# Altium project alarmClock.PrjPcb
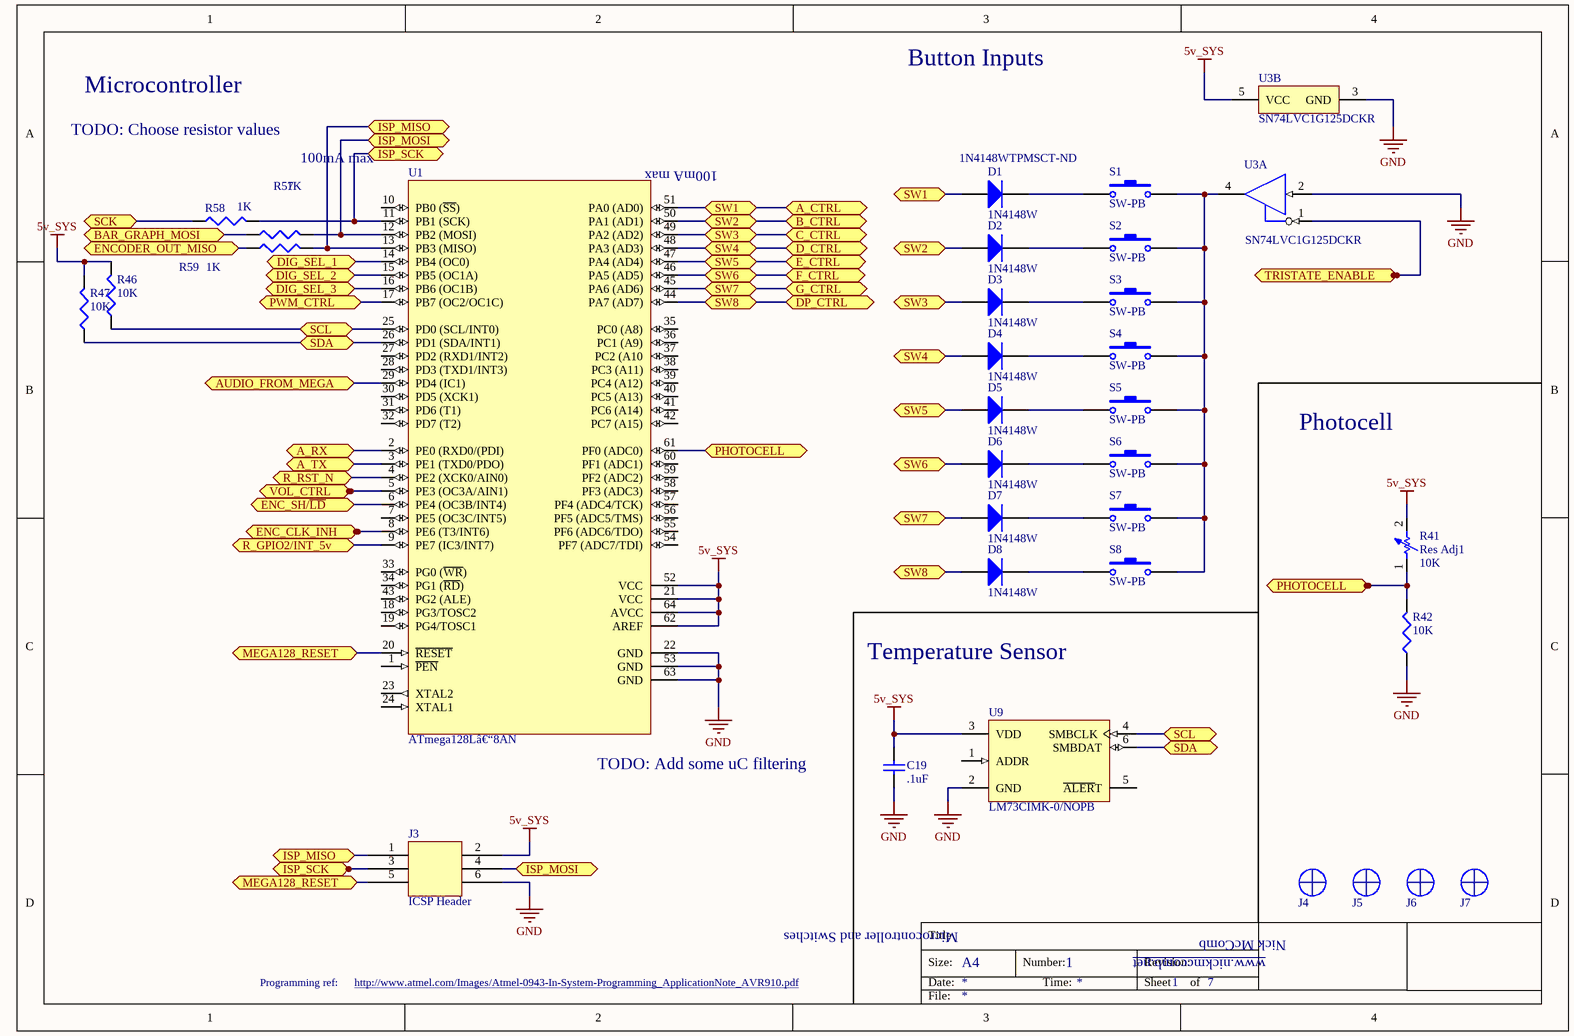
[diagram p0: uC.SchDoc]
7 sheets, 155 parts. Net scope: flat (ports and power ports of the same name join across sheets).
Board file: alarmClock.PcbDoc
Sheets:
  uC.SchDoc
  barGraph.SchDoc
  7Seg.SchDoc
  encoder.SchDoc
  radio.SchDoc
  audioAmp.SchDoc
  serial.SchDoc

## Sheet uC.SchDoc
size A4; Organization: Altium Limited; Address1: L3, 12a Rodborough Rd; Address2: Frenchs Forest; Address3: NSW; Address4: Australia 2086; DocumentNumber: 1; SheetNumber: 1; SheetTotal: 7

### Parts
C19  value .1uF  [C0805]  (hidden comment: 0805 style, by default)
D1  1N4148W  Supplier Part Number 1: 1N4148WTPMSCT-ND  [JSCJ-SOD-123-2_V]
D2  1N4148W  [JSCJ-SOD-123-2_V]
D3  1N4148W  [JSCJ-SOD-123-2_V]
D4  1N4148W  [JSCJ-SOD-123-2_V]
D5  1N4148W  [JSCJ-SOD-123-2_V]
D6  1N4148W  [JSCJ-SOD-123-2_V]
D7  1N4148W  [JSCJ-SOD-123-2_V]
D8  1N4148W  [JSCJ-SOD-123-2_V]
J3  ICSP Header  [ICSP Header]
J4  MountingHoles  [Mounting Hole - Single]  (value not drawn)
J5  MountingHoles  [Mounting Hole - Single]  (value not drawn)
J6  MountingHoles  [Mounting Hole - Single]  (value not drawn)
J7  MountingHoles  [Mounting Hole - Single]  (value not drawn)
R41  Res Adj1  value 10K  [PHOTOCELL]
R42  10K  [J1-0603]
R46  10K  [J1-0603]
R47  10K  [J1-0603]
R57  1K  [J1-0603]
R58  1K  [J1-0603]
R59  1K  [J1-0603]
S1  SW-PB  [SW-PB]
S2  SW-PB  [SW-PB]
S3  SW-PB  [SW-PB]
S4  SW-PB  [SW-PB]
S5  SW-PB  [SW-PB]
S6  SW-PB  [SW-PB]
S7  SW-PB  [SW-PB]
S8  SW-PB  [SW-PB]
U1  ATmega128Lâ€“8AN  [64A_M]
U3  SN74LVC1G125DCKR  [DCK0005A_M]  (parts A,B of 2)
U9  LM73CIMK-0/NOPB  [DDC0006A_M]

### Ports
A_CTRL, A_RX, A_TX, AUDIO_FROM_MEGA, B_CTRL, BAR_GRAPH_MOSI, C_CTRL, D_CTRL, DIG_SEL_1, DIG_SEL_2, DIG_SEL_3, DP_CTRL, E_CTRL, ENC_CLK_INH, ENC_SH/~{LD}, ENCODER_OUT_MISO, F_CTRL, G_CTRL, ISP_MISO, ISP_MOSI, ISP_SCK, MEGA128_RESET, PHOTOCELL, PWM_CTRL, R_GPIO2/INT_5v, R_RST_N, SCK, SCL, SDA, SW1, SW2, SW3, SW4, SW5, SW6, SW7, SW8, TRISTATE_ENABLE, VOL_CTRL

### Nets
5v_SYS: C19.2 J3.2 R41.2 R46.2 R47.2 U1.21(VCC) U1.52(VCC) U1.62(AREF) U1.64(AVCC) U3.5(VCC) U9.3(VDD)
GND: C19.1 J3.6 R42.1 U1.22(GND) U1.53(GND) U1.63(GND) U3.2(A) U3.3(GND) U9.2(GND)
NetC3_1: U1.29(PD4_(IC1)) ; port AUDIO_FROM_MEGA
NetD1_1: D1.1(+) U1.51(PA0_(AD0)) ; port SW1, port A_CTRL
NetD1_2: D1.2(-) S1.1
NetD2_1: D2.1(+) U1.50(PA1_(AD1)) ; port SW2, port B_CTRL
NetD2_2: D2.2(-) S2.1
NetD3_1: D3.1(+) U1.49(PA2_(AD2)) ; port SW3, port C_CTRL
NetD3_2: D3.2(-) S3.1
NetD4_1: D4.1(+) U1.48(PA3_(AD3)) ; port SW4, port D_CTRL
NetD4_2: D4.2(-) S4.1
NetD5_1: D5.1(+) U1.47(PA4_(AD4)) ; port SW5, port E_CTRL
NetD5_2: D5.2(-) S5.1
NetD6_1: D6.1(+) U1.46(PA5_(AD5)) ; port SW6, port F_CTRL
NetD6_2: D6.2(-) S6.1
NetD7_1: D7.1(+) U1.45(PA6_(AD6)) ; port SW7, port G_CTRL
NetD7_2: D7.2(-) S7.1
NetD8_1: D8.1(+) U1.44(PA7_(AD7)) ; port SW8, port DP_CTRL
NetD8_2: D8.2(-) S8.1
NetJ3_1: J3.1 R59.2 U1.13(PB3_(MISO)) ; port ISP_MISO
NetJ3_3: J3.3 R58.2 U1.11(PB1_(SCK)) ; port ISP_SCK
NetJ3_4: J3.4 R57.2 U1.12(PB2_(MOSI)) ; port ISP_MOSI
NetJ3_5: J3.5 U1.20(~{RESET}) ; port MEGA128_RESET
NetQ7_2: U1.4(PE2_(XCK0/AIN0)) ; port R_RST_N
NetR30_1: U1.17(PB7_(OC2/OC1C)) ; port PWM_CTRL
NetR41_1: R41.1 R42.2 U1.61(PF0_(ADC0)) ; port PHOTOCELL
NetR45_1: U1.5(PE3_(OC3A/AIN1)) ; port VOL_CTRL
NetR46_1: R46.1 U1.25(PD0_(SCL/INT0)) U9.4(SMBCLK) ; port SCL
NetR47_1: R47.1 U1.26(PD1_(SDA/INT1)) U9.6(SMBDAT) ; port SDA
NetR57_1: R57.1 ; port BAR_GRAPH_MOSI
NetR58_1: R58.1 ; port SCK
NetR59_1: R59.1 ; port ENCODER_OUT_MISO
NetS1_2: S1.2 S2.2 S3.2 S4.2 S5.2 S6.2 S7.2 S8.2 U3.4(Y)
NetU1_2: U1.2(PE0_(RXD0/(PDI)) ; port A_RX
NetU1_3: U1.3(PE1_(TXD0/PDO)) ; port A_TX
NetU1_6: U1.6(PE4_(OC3B/INT4)) ; port ENC_SH/~{LD}
NetU1_8: U1.8(PE6_(T3/INT6)) ; port ENC_CLK_INH
NetU1_9: U1.9(PE7_(IC3/INT7)) ; port R_GPIO2/INT_5v
NetU1_14: U1.14(PB4_(OC0)) ; port DIG_SEL_1
NetU1_15: U1.15(PB5_(OC1A)) ; port DIG_SEL_2
NetU1_16: U1.16(PB6_(OC1B)) ; port DIG_SEL_3
NetU2_7: U3.1(~{OE}) ; port TRISTATE_ENABLE

Not connected (* = marked no-connect by the designer): U1 1(~{PEN}) 7(PE5_(OC3C/INT5)) 10(PB0_(~{SS})) 18(PG3/TOSC2) 19(PG4/TOSC1) 23(XTAL2) 24(XTAL1) 27(PD2_(RXD1/INT2)) 28(PD3_(TXD1/INT3)) 30(PD5_(XCK1)) 31(PD6_(T1)) 32(PD7_(T2)) 33(PG0_(~{WR})) 34(PG1_(~{RD})) 35(PC0_(A8)) 36(PC1_(A9)) 37(PC2_(A10) 38(PC3_(A11)) 39(PC4_(A12)) 40(PC5_(A13)) 41(PC6_(A14)) 42(PC7_(A15)) 43(PG2_(ALE)) 54(PF7_(ADC7/TDI)) 55(PF6_(ADC6/TDO)) 56(PF5_(ADC5/TMS)) 57(PF4_(ADC4/TCK)) 58(PF3_(ADC3)) 59(PF2_(ADC2)) 60(PF1_(ADC1)); U9 1(ADDR) 5(~{ALER}T)

### Notes on the sheet
- Microcontroller
- Button Inputs
- TODO: Choose resistor values
- 100mA max
- Photocell
- Temperature Sensor
- TODO: Add some uC filtering
- Microcontroller and Switches
- Programming ref:
- http://www.atmel.com/Images/Atmel-0943-In-System-Programming_ApplicationNote_AVR910.pdf
- Title
- Size:
- Date:
- A4
- Number:
- Time:
- Revision:
- Sheet
- of
- www.nickmccomb.net
- Nick McComb
- File:

### Library data of the parts
C19 = Cap: Capacitor; Published: 8-Jun-2000; LatestRevisionDate: 17-Jul-2002; LatestRevisionNote: Re-released for DXP Platform.; PackageReference: RAD-0.3; Publisher: Altium Limited; PackageDescription: Radial Cap, Thru-Hole; 2 Leads; 0.3 in Pin Spacing
D1-D8 = CMP-0914-00001-1: Fast Switching Diode, 75 V, 150 mA, 2-Pin 2.7 x 1.6 x 1.25 mm SMD, Tape and Reel; Manufacturer: Changjiang Electronics; Manufacturer Part Number: 1N4148W-TP; TSTG (degC): -55 to 150; IR (uA): 1; VR (V): 75; VF (V): 1.25; PD (mW): 350; Trr (ns): 4; IO (mA): 150; Description: DIODE GEN PURP 100V 150MA SOD123; Average Forward Current-Max: 0.15 A; Peak Current-Max: 2 A; Power Dissipation: 400 mW; Reverse Voltage-Max [Vrrm]: 100 V; Reverse Recovery Time-Max: 4 ns; Packing: Tape and Reel; ComponentLink2URL: http://www.cj-elec.com/txUpfile/20121613352740313.pdf; PackageReference: SOD-123-2; PackageVersion: Rev. A; DatasheetVersion: Rev. A; ComponentLink3Description: Package Specification; ComponentLink3URL: http://www.cj-elec.com/txUpfile/201412112231195145.pdf; ComponentLink1Description: Manufacturer URL; ComponentLink1URL: http://www.cj-elec.com/; PartNumber: 1N4148W; ComponentLink2Description: Datasheet; PackageDescription: 2-Pin SMD, Body 2.7 x 1.6 mm, Height 1.25 mm; Mounting Technology: Surface Mount; Supplier 1: Digikey; Stock 1: 1103127; Pricing 1: 1=0.14, 10=0.125, 25=0.1132, 100=0.0815, 250=0.048, 500=0.0399, 1000=0.0272 (USD); ComponentLink4URL: https://datasheet.ciiva.com/1243/1684829-1243908.pdf; ComponentLink4Description: https://datasheet.ciiva.com/1243/1684829-1243908.pdf; ComponentLink5URL: https://datasheet.ciiva.com/16836/1n4148wsod123-16836277.pdf; ComponentLink5Description: https://datasheet.ciiva.com/16836/1n4148wsod123-16836277.pdf; ComponentLink6URL: https://datasheet.ciiva.com/4435/1n4148wsod123-48460-4435223.pdf; ComponentLink6Description: https://datasheet.ciiva.com/4435/1n4148wsod123-48460-4435223.pdf; ComponentLink7URL: https://datasheet.ciiva.com/14557/70055519-14557767.pdf; ComponentLink7Description: https://datasheet.ciiva.com/14557/70055519-14557767.pdf; ComponentLink8URL: https://datasheet.ciiva.com/911/1n4148wsod123-911676.pdf; ComponentLink8Description: https://datasheet.ciiva.com/911/1n4148wsod123-911676.pdf; ComponentLink9URL: https://datasheet.ciiva.com/7622/1684829-7622556.pdf; ComponentLink9Description: https://datasheet.ciiva.com/7622/1684829-7622556.pdf; ComponentLink10URL: https://datasheet.ciiva.com/911/1n4148wsod123-911677.pdf; ComponentLink10Description: https://datasheet.ciiva.com/911/1n4148wsod123-911677.pdf; ComponentLink11URL: https://datasheet.ciiva.com/911/1n4148wsod123-911678.pdf; ComponentLink11Description: https://datasheet.ciiva.com/911/1n4148wsod123-911678.pdf; ComponentLink12URL: https://datasheet.ciiva.com/22747/1684829-22747439.pdf; ComponentLink12Description: https://datasheet.ciiva.com/22747/1684829-22747439.pdf
  D2-D8: Supplier Part Number 1: 1N4148WTPMSCT-ND
R41 = Res Adj1: Variable Resistor; ComponentLink1URL: http://cdn.sparkfun.com/datasheets/Sensors/LightImaging/SEN-09088.pdf; ComponentLink1Description: A Photocell Datasheet
R42 R46 R47 R57-R59 = Res3: Resistor; Published: 8-Jun-2000; LatestRevisionDate: 29-May-2009; LatestRevisionNote: IPC-7351 Footprint Added.; PackageReference: J1-0603; Publisher: Altium Limited; PackageDescription: Chip Resistor
  R42 R46 R47: Value: 10K
  R57-R59: Value: 1K
S1-S8 = SW-PB: Switch
U1 = CMP-0095-00651-1: 8-bit AVR Microcontroller, 3.0-5.5V, 128KB Flash, 4KB EEPROM, 4KB SRAM, 64-pin TQFP, Extended Grade (-40°C to 105°C); PackageVersion: revC, Oct-2010; PackageDescription: 64-Pin Plastic Thin Profile Quad Flat Pack, 14 x 14 x 1.0 mm Body, 0.8 mm Pitch (TQFP); Code_JEDEC: MS-026-AEB; ComponentLink3Description: ATmega128(L) Summary; ComponentLink1URL: http://www.atmel.com/; PackageReference: 64A; ComponentLink2URL: http://www.atmel.com/dyn/resources/prod_documents/doc2467.pdf; DatasheetVersion: revX, Jun-2011; ComponentLink3URL: http://www.atmel.com/dyn/resources/prod_documents/2467S.pdf; ComponentLink2Description: ATmega128(L) Datasheet; ComponentLink1Description: Manufacturer URL
U3 = CMP-0859-00281-3: Single Bus Buffer Gate With 3-State Outputs, DCK0005A, LARGE T&R; Manufacturer: Texas Instruments; Bits(#): 1; tpd @ Nom Voltage(Max)(ns): 9,5.5,4.5,4; 3-State Output: Yes; Output Type: CMOS; Sub-Family: Non-Inverting Buffer/Driver; Logic: True; Output Drive (IOL/IOH)(Max)(mA): 32/-32; Voltage(Nom)(V): 1.8,2.5,3.3,5; ICC @ Nom Voltage(Max)(mA): 0.01; Technology Family: LVC; VCC(Min)(V): 1.65; VCC(Max)(V): 5.5; F @ Nom Voltage(Max)(Mhz): 150; Rating: Catalog; Input Type: CMOS/TTL; Schmitt Trigger: No; PackageReference: DCK0005A; Generic Part Number: SN74LVC1G125; DatasheetVersion: SCES223T; Operating Temperature Range(C): -40 to 125,-40 to 85; PartId: 1
U9 = CMP-0066-00221-3: 2.7V, 11- to 14- Bit Digital Temperature Sensor with 2-Wire Interface, 6-pin Tiny SOT23, Pb-Free; Manufacturer: Texas Instruments; PackageTopMarking: T730*XTT; PowerWise: Y; CompType: Temp Sensor IC; PackageDescription: Molded TSOT, 2.97 x 1.65 x 0.87mm Body, 6 Lead, 0.95mm Pitch; ComponentLink1Description: Datasheet URL; ComponentLink1URL: http://www.ti.com/general/docs/lit/getliterature.tsp?genericPartNumber=LM73&fileType=pdf; Code_IPC: SOT26A-6; RoHS: Y; PinCount: 6; Code_JEDEC: MO-193-AA; PackageReference: DDC0006A

## Sheet barGraph.SchDoc
size A4; Organization: Altium Limited; Address1: L3, 12a Rodborough Rd; Address2: Frenchs Forest; Address3: NSW; Address4: Australia 2086; DocumentNumber: 2; SheetNumber: 2; SheetTotal: 7
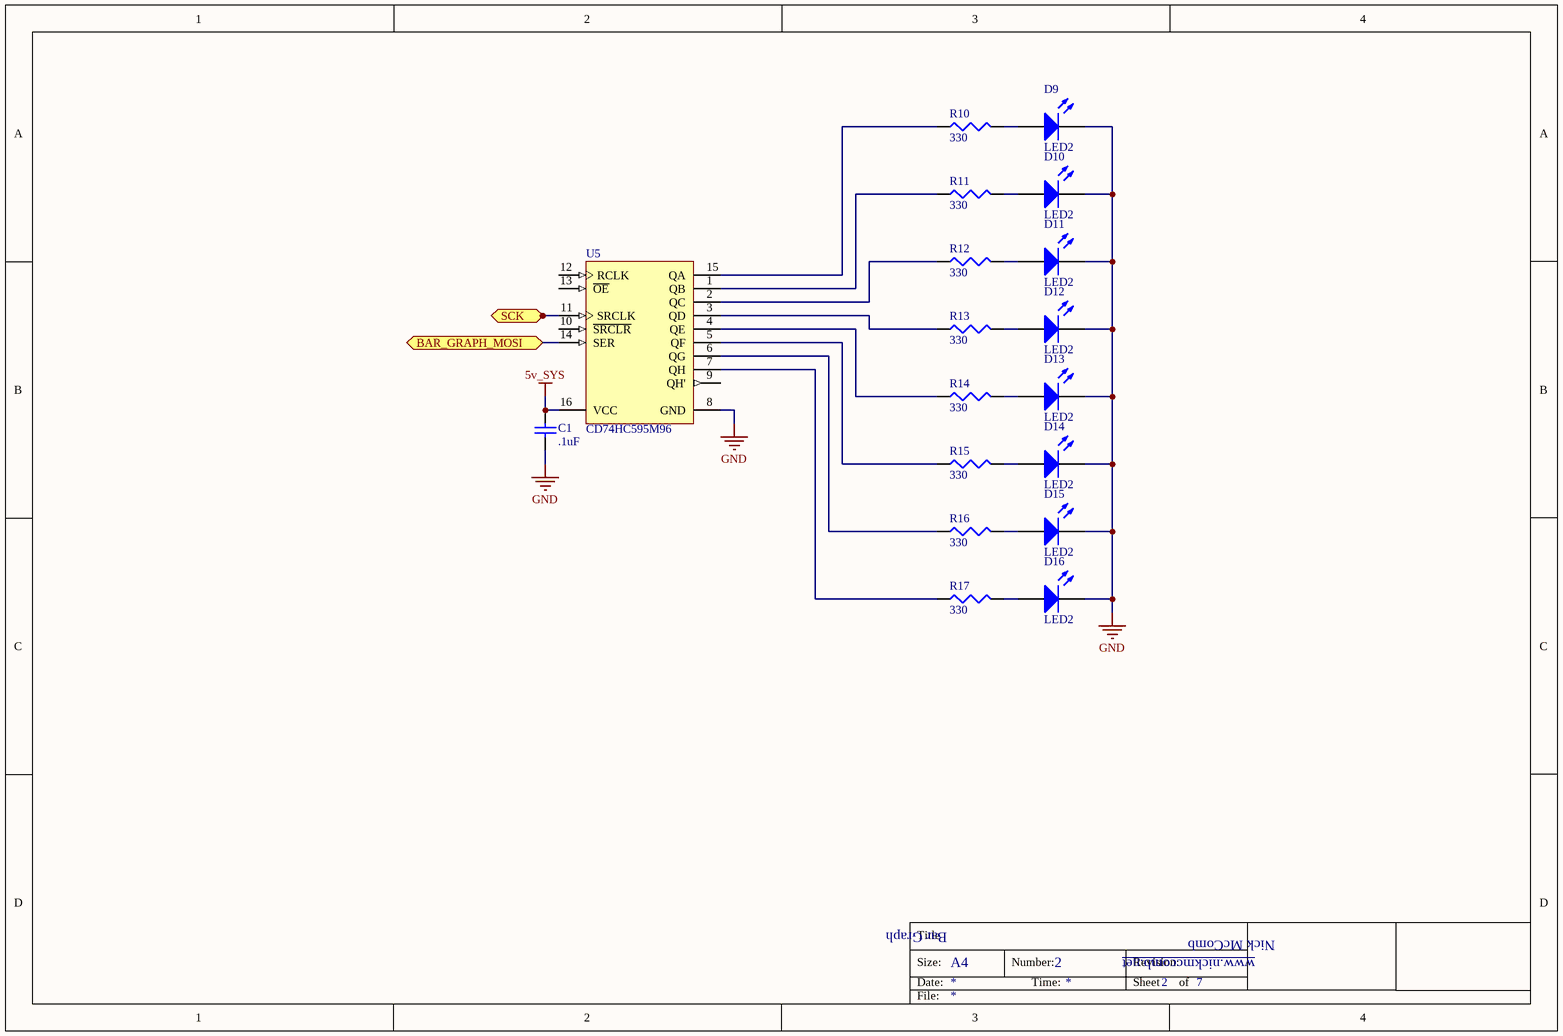
[diagram p1: barGraph.SchDoc]

### Parts
C1  value .1uF  [C0805]  (hidden comment: 0805 style, by default)
D9  LED2  [basic_led]
D10  LED2  [basic_led]
D11  LED2  [basic_led]
D12  LED2  [basic_led]
D13  LED2  [basic_led]
D14  LED2  [basic_led]
D15  LED2  [basic_led]
D16  LED2  [basic_led]
R10  330  [J1-0603]
R11  330  [J1-0603]
R12  330  [J1-0603]
R13  330  [J1-0603]
R14  330  [J1-0603]
R15  330  [J1-0603]
R16  330  [J1-0603]
R17  330  [J1-0603]
U5  CD74HC595M96  [D0016A_L]

### Ports
BAR_GRAPH_MOSI, SCK

### Nets
5v_SYS: C1.2 U5.16(VCC)
GND: C1.1 D9.2(K) D10.2(K) D11.2(K) D12.2(K) D13.2(K) D14.2(K) D15.2(K) D16.2(K) U5.8(GND)
NetD9_1: D9.1(A) R10.2
NetD10_1: D10.1(A) R11.2
NetD11_1: D11.1(A) R12.2
NetD12_1: D12.1(A) R13.2
NetD13_1: D13.1(A) R14.2
NetD14_1: D14.1(A) R15.2
NetD15_1: D15.1(A) R16.2
NetD16_1: D16.1(A) R17.2
NetR10_1: R10.1 U5.15(QA)
NetR11_1: R11.1 U5.1(QB)
NetR12_1: R12.1 U5.2(QC)
NetR13_1: R13.1 U5.3(QD)
NetR14_1: R14.1 U5.4(QE)
NetR15_1: R15.1 U5.5(QF)
NetR16_1: R16.1 U5.6(QG)
NetR17_1: R17.1 U5.7(QH)
NetR57_1: U5.14(SER) ; port BAR_GRAPH_MOSI
NetR58_1: U5.11(SRCLK) ; port SCK

Not connected (* = marked no-connect by the designer): U5 9(QH') 10(~{SRCLR}) 12(RCLK) 13(~{OE})

### Notes on the sheet
- Bar Graph
- Title
- Size:
- Date:
- A4
- Number:
- Time:
- Revision:
- Sheet
- of
- www.nickmccomb.net
- Nick McComb
- File:

### Library data of the parts
C1 = Cap: Capacitor; Published: 8-Jun-2000; LatestRevisionDate: 17-Jul-2002; LatestRevisionNote: Re-released for DXP Platform.; PackageReference: RAD-0.3; Publisher: Altium Limited; PackageDescription: Radial Cap, Thru-Hole; 2 Leads; 0.3 in Pin Spacing
D9-D16 = LED2: Typical RED, GREEN, YELLOW, AMBER GaAs LED; Published: 8-Jun-2000; LatestRevisionDate: 17-Jul-2002; LatestRevisionNote: Re-released for DXP Platform.; PackageVersion: Feb-2002; PackageReference: 3.2X1.6X1.1; Publisher: Altium Limited; PackageDescription: SM LED; 2 Flat Leads
R10-R17 = Res3: Resistor; Published: 8-Jun-2000; LatestRevisionDate: 29-May-2009; LatestRevisionNote: IPC-7351 Footprint Added.; PackageReference: J1-0603; Publisher: Altium Limited; PackageDescription: Chip Resistor; Value: 330
U5 = CMP-0807-00025-1: 8-Bit Shift Registers With 3-State Output Registers, D0016A, LARGE T&R; ICC @ Nom Voltage(Max)(mA): 0.08; 3-State Output: Yes; Input Type: CMOS; VCC(Max)(V): 6; Bits: 8; No. of Outputs: 9; VCC(Min)(V): 2; F @ Nom Voltage(Max)(Mhz): 28; Technology Family: HC; tpd @ Nom Voltage(Max)(ns): 41; Output Drive (IOL/IOH)(Max)(mA): 7.8/-7.8; Rating: Catalog; PackageVersion: http://www.ti.com/lit/ml/mpds178g/mpds178g.pdf; Code_IPC: MS-012 variation AC; Operating Temperature Range(C): -55 to 125; ComponentLink2Description: Datasheet; ComponentLink1Description: Manufacturer URL; ComponentLink2URL: http://www.ti.com/lit/ds/symlink/cd74hc595.pdf; PackageReference: D0016A; PartNumber: CD74HC595M96; Part Number: CD74HC595; DatasheetVersion: SCHS353; ComponentLink1URL: http://www.ti.com/; Output Type: CMOS; Voltage(Nom)(V): 6

## Sheet 7Seg.SchDoc
size A4; Organization: Altium Limited; Address1: L3, 12a Rodborough Rd; Address2: Frenchs Forest; Address3: NSW; Address4: Australia 2086; DocumentNumber: 3; SheetNumber: 3; SheetTotal: 7
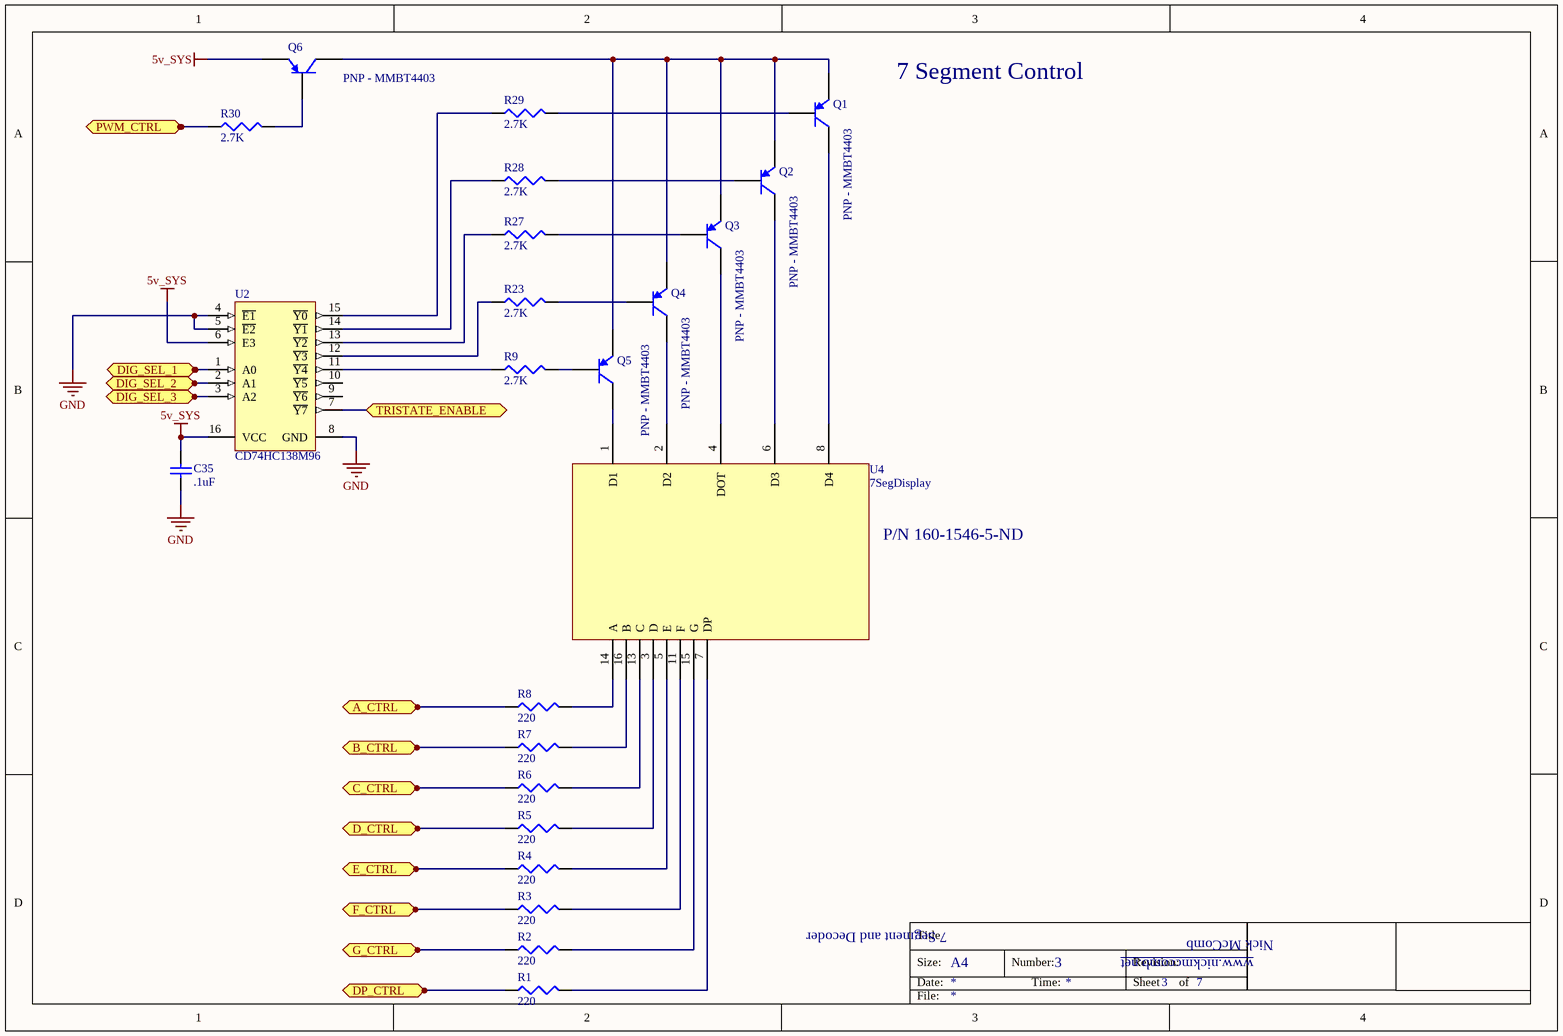
[diagram p2: 7Seg.SchDoc]

### Parts
C35  value .1uF  [C0805]  (hidden comment: 0805 style, by default)
Q1  PNP - MMBT4403  [TO-92A - BJT]
Q2  PNP - MMBT4403  [TO-92A - BJT]
Q3  PNP - MMBT4403  [TO-92A - BJT]
Q4  PNP - MMBT4403  [TO-92A - BJT]
Q5  PNP - MMBT4403  [TO-92A - BJT]
Q6  PNP - MMBT4403  [TO-92A - BJT]
R1  220  [J1-0603]
R2  220  [J1-0603]
R3  220  [J1-0603]
R4  220  [J1-0603]
R5  220  [J1-0603]
R6  220  [J1-0603]
R7  220  [J1-0603]
R8  220  [J1-0603]
R9  2.7K  [J1-0603]
R23  2.7K  [J1-0603]
R27  2.7K  [J1-0603]
R28  2.7K  [J1-0603]
R29  2.7K  [J1-0603]
R30  2.7K  [J1-0603]
U2  CD74HC138M96  [D0016A_L]
U4  7SegDisplay  [LTC-4627JS]

### Ports
A_CTRL, B_CTRL, C_CTRL, D_CTRL, DIG_SEL_1, DIG_SEL_2, DIG_SEL_3, DP_CTRL, E_CTRL, F_CTRL, G_CTRL, PWM_CTRL, TRISTATE_ENABLE

### Nets
5v_SYS: C35.2 Q6.3(E) U2.6(E3) U2.16(VCC)
GND: C35.1 U2.4(~{E1}) U2.5(~{E2}) U2.8(GND)
NetD1_1: R8.1 ; port A_CTRL
NetD2_1: R7.1 ; port B_CTRL
NetD3_1: R6.1 ; port C_CTRL
NetD4_1: R5.1 ; port D_CTRL
NetD5_1: R4.1 ; port E_CTRL
NetD6_1: R3.1 ; port F_CTRL
NetD7_1: R2.1 ; port G_CTRL
NetD8_1: R1.1 ; port DP_CTRL
NetQ1_1: Q1.1(C) U4.8(D4)
NetQ1_2: Q1.2(B) R29.2
NetQ1_3: Q1.3(E) Q2.3(E) Q3.3(E) Q4.3(E) Q5.3(E) Q6.1(C)
NetQ2_1: Q2.1(C) U4.6(D3)
NetQ2_2: Q2.2(B) R28.2
NetQ3_1: Q3.1(C) U4.4(DOT)
NetQ3_2: Q3.2(B) R27.2
NetQ4_1: Q4.1(C) U4.2(D2)
NetQ4_2: Q4.2(B) R23.2
NetQ5_1: Q5.1(C) U4.1(D1)
NetQ5_2: Q5.2(B) R9.2
NetQ6_2: Q6.2(B) R30.2
NetR1_2: R1.2 U4.7(DP)
NetR2_2: R2.2 U4.15(G)
NetR3_2: R3.2 U4.11(F)
NetR4_2: R4.2 U4.5(E)
NetR5_2: R5.2 U4.3(D)
NetR6_2: R6.2 U4.13(C)
NetR7_2: R7.2 U4.16(B)
NetR8_2: R8.2 U4.14(A)
NetR9_1: R9.1 U2.11(~{Y4})
NetR23_1: R23.1 U2.12(~{Y3})
NetR27_1: R27.1 U2.13(~{Y2})
NetR28_1: R28.1 U2.14(~{Y1})
NetR29_1: R29.1 U2.15(~{Y0})
NetR30_1: R30.1 ; port PWM_CTRL
NetU1_14: U2.1(A0) ; port DIG_SEL_1
NetU1_15: U2.2(A1) ; port DIG_SEL_2
NetU1_16: U2.3(A2) ; port DIG_SEL_3
NetU2_7: U2.7(~{Y7}) ; port TRISTATE_ENABLE

Not connected (* = marked no-connect by the designer): U2 9(~{Y6}) 10(~{Y5})

### Notes on the sheet
- 7 Segment Control
- P/N 160-1546-5-ND
- 7 Segment and Decoder
- Title
- Size:
- Date:
- A4
- Number:
- Time:
- Revision:
- Sheet
- of
- www.nickmccomb.net
- Nick McComb
- File:

### Library data of the parts
C35 = Cap: Capacitor; Published: 8-Jun-2000; LatestRevisionDate: 17-Jul-2002; LatestRevisionNote: Re-released for DXP Platform.; PackageReference: RAD-0.3; Publisher: Altium Limited; PackageDescription: Radial Cap, Thru-Hole; 2 Leads; 0.3 in Pin Spacing
Q1-Q6 = PNP - MMBT4403: PNP Bipolar Transistor
R1-R9 R23 R27-R30 = Res3: Resistor; Published: 8-Jun-2000; LatestRevisionDate: 29-May-2009; LatestRevisionNote: IPC-7351 Footprint Added.; PackageReference: J1-0603; Publisher: Altium Limited; PackageDescription: Chip Resistor
  R1-R8: Value: 220
  R9 R23 R27-R30: Value: 2.7K
U2 = CMP-1633-00157-2: High Speed CMOS Logic 3-to-8 Line Decoder Demultiplexer Inverting and Non-Inverting, D0016A, LARGE T&R; Manufacturer: Texas Instruments; VCC(Max)(V): 6; Technology Family: HC; Function: Decoder/Demultiplexer; tpd @ Nom Voltage(Max)(ns): 30; ICC @ Nom Voltage(Max)(mA): 0.08; Input Type: LVTTL/CMOS; Configuration: 3：8; Voltage(Nom)(V): 3.3,5; Schmitt Trigger: No; Channels(#): 1; Output Drive (IOL/IOH)(Max)(mA): 5.2/-5.2; F @ Nom Voltage(Max)(Mhz): 28; VCC(Min)(V): 2; Bits(#): 8; Rating: Catalog; PackageReference: D0016A; Operating Temperature Range(C): -55 to 125; Code_JEDEC: MS-012 variation AC; Generic Part Number: CD74HC138; Output Type: CMOS; DatasheetVersion: SCHS147I; Type: Standard

## Sheet encoder.SchDoc
size A4; Organization: Altium Limited; Address1: L3, 12a Rodborough Rd; Address2: Frenchs Forest; Address3: NSW; Address4: Australia 2086; DocumentNumber: 4; SheetNumber: 4; SheetTotal: 7
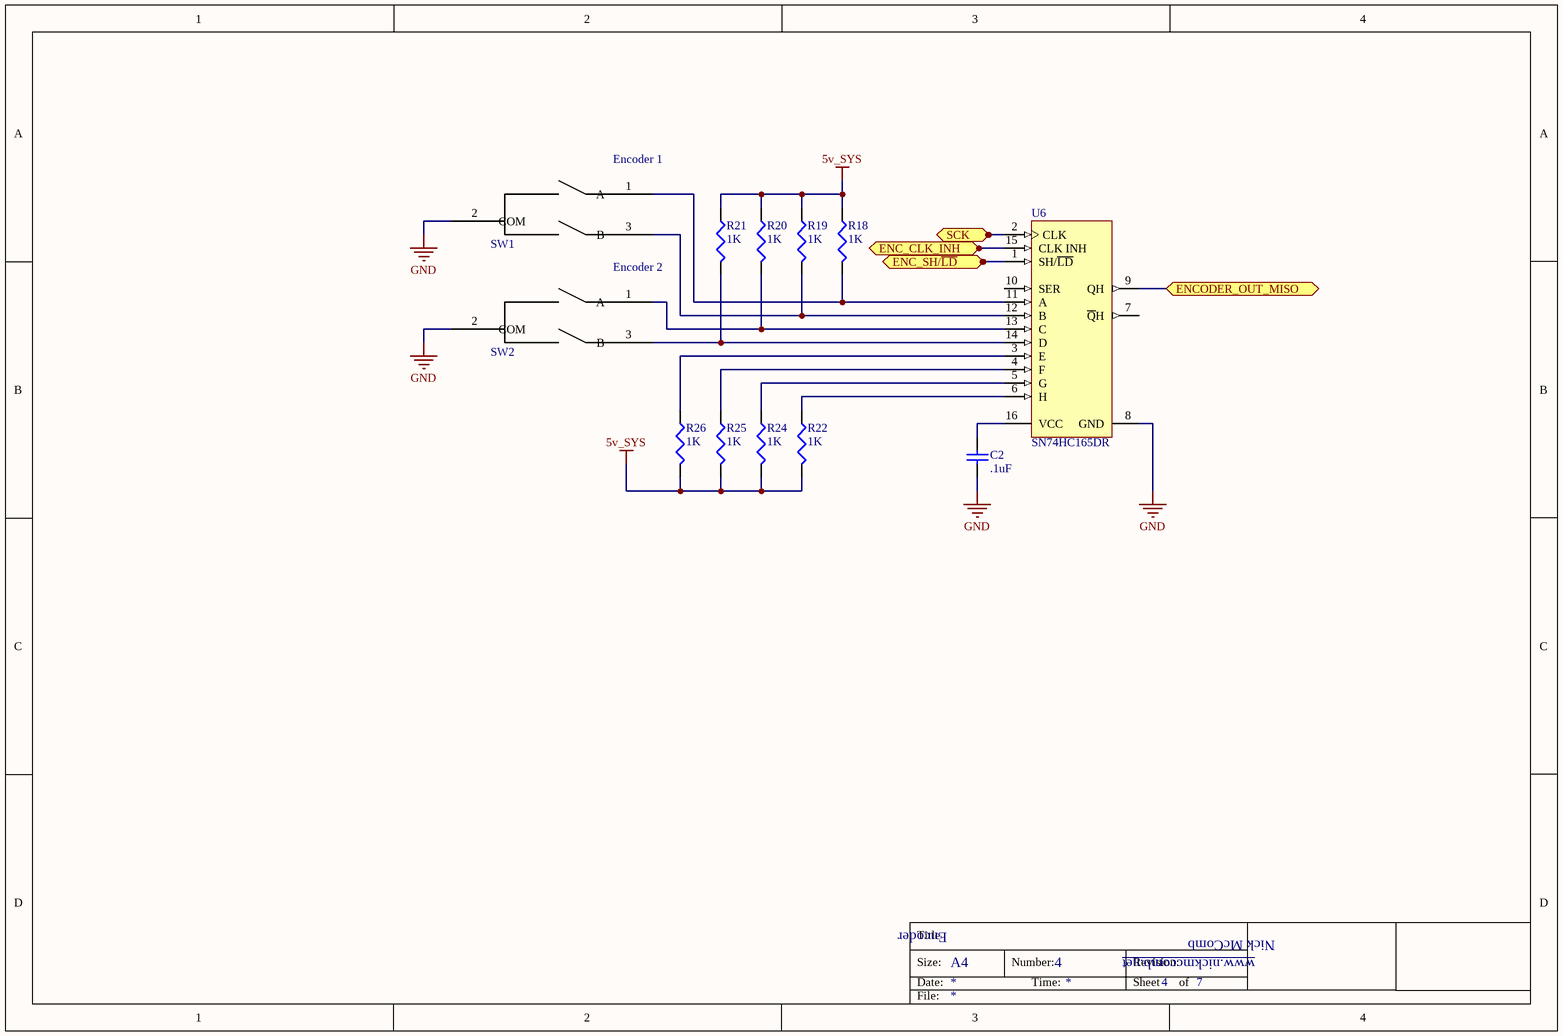
[diagram p3: encoder.SchDoc]

### Parts
C2  value .1uF  [C0805]  (hidden comment: 0805 style, by default)
R18  1K  [J1-0603]
R19  1K  [J1-0603]
R20  1K  [J1-0603]
R21  1K  [J1-0603]
R22  1K  [J1-0603]
R24  1K  [J1-0603]
R25  1K  [J1-0603]
R26  1K  [J1-0603]
SW1  ENCODER  [ENCODER]  (value not drawn)
SW2  ENCODER  [ENCODER]  (value not drawn)
U6  SN74HC165DR  [D0016A_L]

### Ports
ENC_CLK_INH, ENC_SH/~{LD}, ENCODER_OUT_MISO, SCK

### Nets
5v_SYS: R18.2 R19.2 R20.2 R21.2 R22.1 R24.1 R25.1 R26.1
GND: C2.1 SW1.2(COM) SW2.2(COM) U6.8(GND)
NetC2_2: C2.2 U6.16(VCC)
NetR18_1: R18.1 SW1.1(A) U6.11(A)
NetR19_1: R19.1 SW1.3(B) U6.12(B)
NetR20_1: R20.1 SW2.1(A) U6.13(C)
NetR21_1: R21.1 SW2.3(B) U6.14(D)
NetR22_2: R22.2 U6.6(H)
NetR24_2: R24.2 U6.5(G)
NetR25_2: R25.2 U6.4(F)
NetR26_2: R26.2 U6.3(E)
NetR58_1: U6.2(CLK) ; port SCK
NetR59_1: U6.9(QH) ; port ENCODER_OUT_MISO
NetU1_6: U6.1(SH/~{LD}) ; port ENC_SH/~{LD}
NetU1_8: U6.15(CLK_INH) ; port ENC_CLK_INH

Not connected (* = marked no-connect by the designer): U6 7(~{Q}H) 10(SER)

### Notes on the sheet
- (near SW1) Encoder 1
- Encoder 2
- Encoder
- Title
- Size:
- Date:
- A4
- Number:
- Time:
- Revision:
- Sheet
- of
- www.nickmccomb.net
- Nick McComb
- File:

### Library data of the parts
C2 = Cap: Capacitor; Published: 8-Jun-2000; LatestRevisionDate: 17-Jul-2002; LatestRevisionNote: Re-released for DXP Platform.; PackageReference: RAD-0.3; Publisher: Altium Limited; PackageDescription: Radial Cap, Thru-Hole; 2 Leads; 0.3 in Pin Spacing
R18-R22 R24-R26 = Res3: Resistor; Published: 8-Jun-2000; LatestRevisionDate: 29-May-2009; LatestRevisionNote: IPC-7351 Footprint Added.; PackageReference: J1-0603; Publisher: Altium Limited; PackageDescription: Chip Resistor; Value: 1K
U6 = CMP-0780-00020-1: 8-Bit Parallel-Load Shift Registers, D0016A, LARGE T&R; F @ Nom Voltage(Max)(Mhz): 28; Rating: Catalog; VCC(Max)(V): 6; VCC(Min)(V): 2; tpd @ Nom Voltage(Max)(ns): 38; Output Drive (IOL/IOH)(Max)(mA): 5.2/-5.2; Bits: 8; 3-State Output: No; Output Type: CMOS; ICC @ Nom Voltage(Max)(mA): 0.08; Technology Family: HC; Operating Temperature Range(C): -40 to 125; PartNumber: SN74HC165DR; Code_IPC: MS-012 variation AC; PackageReference: D0016A; ComponentLink1Description: Manufacturer URL; ComponentLink2URL: http://www.ti.com/lit/ds/symlink/sn74hc165.pdf; Input Type: CMOS; ComponentLink2Description: Datasheet; PackageVersion: http://www.ti.com/lit/ml/mpds178g/mpds178g.pdf; Part Number: SN74HC165; ComponentLink1URL: http://www.ti.com/; Voltage(Nom)(V): 6; DatasheetVersion: SCLS116G

## Sheet radio.SchDoc
size A4; Organization: Altium Limited; Address1: L3, 12a Rodborough Rd; Address2: Frenchs Forest; Address3: NSW; Address4: Australia 2086; DocumentNumber: 5; SheetNumber: 5; SheetTotal: 7
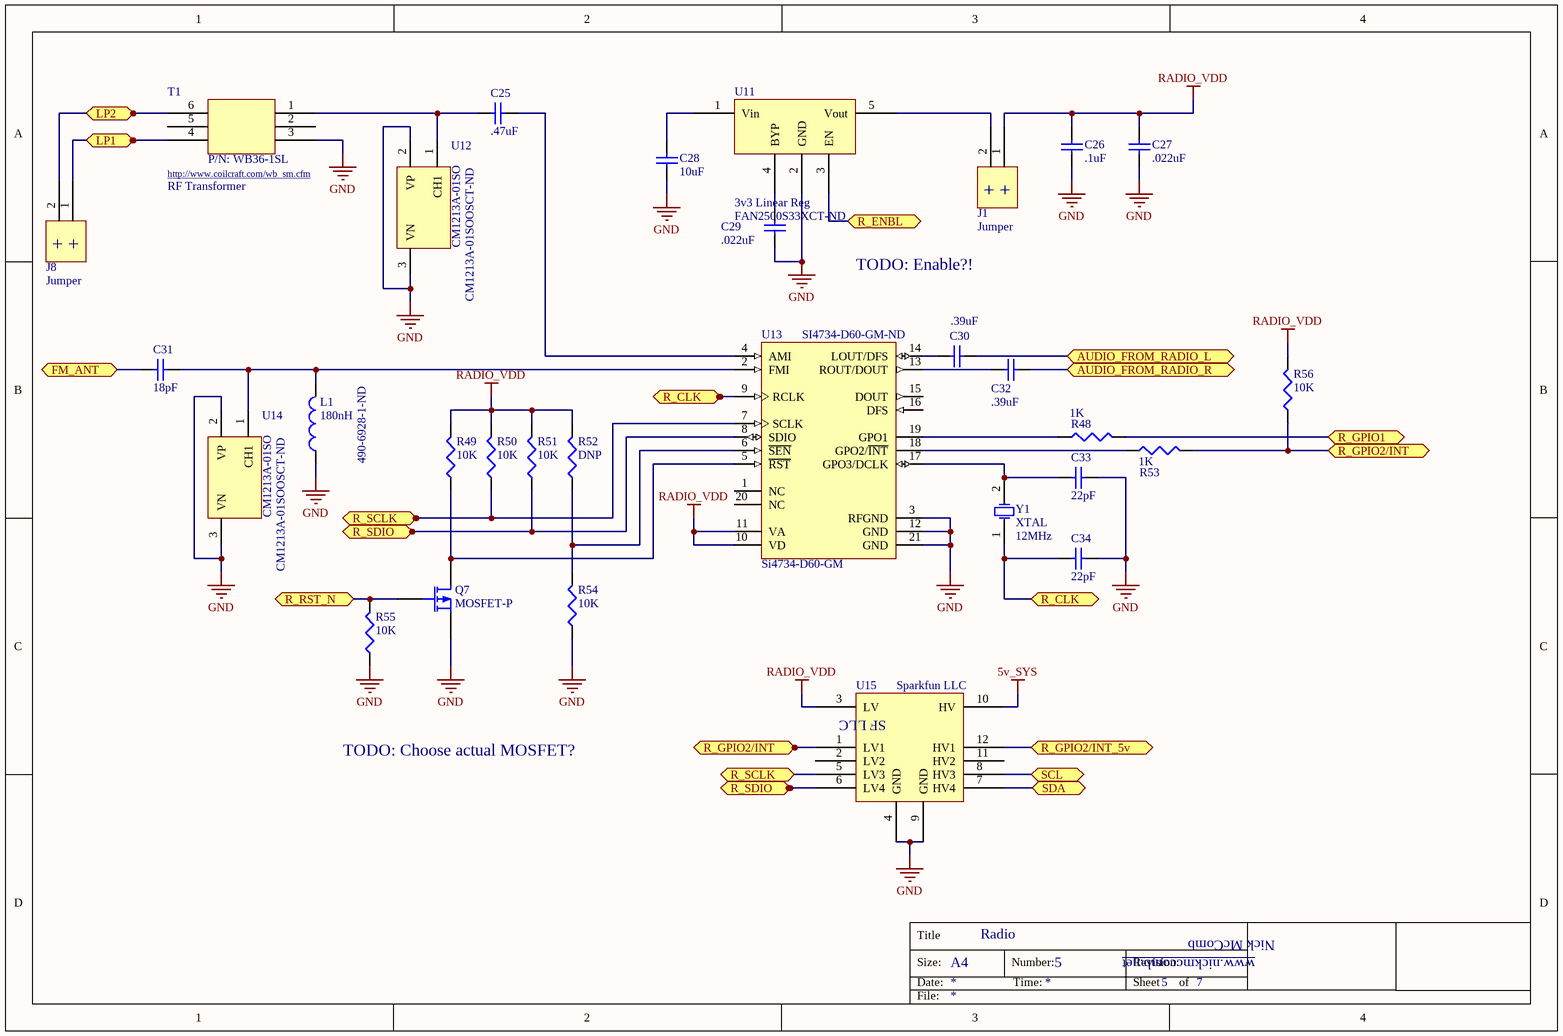
[diagram p4: radio.SchDoc]

### Parts
C25  value .47uF  [C0805]  (hidden comment: 0805 style, by default)
C26  value .1uF  [C0805]  (hidden comment: 0805 style, by default)
C27  value .022uF  [C0805]  (hidden comment: 0805 style, by default)
C28  value 10uF  [C0805]  (hidden comment: 0805 style, by default)
C29  value .022uF  [C0805]  (hidden comment: 0805 style, by default)
C30  value .39uF  [C0805]  (hidden comment: 0805 style, by default)
C31  value 18pF  [C0805]  (hidden comment: 0805 style, by default)
C32  value .39uF  [C0805]  (hidden comment: 0805 style, by default)
C33  value 22pF  [C0805]  (hidden comment: 0805 style, by default)
C34  value 22pF  [C0805]  (hidden comment: 0805 style, by default)
J1  Jumper  [Jumper]
J8  Jumper  [Jumper]
L1  180nH  Supplier Part Number 1: 490-6928-1-ND  [J1-0603]
Q7  MOSFET-P  [E3]
R48  1K  [J1-0603]
R49  10K  [J1-0603]
R50  10K  [J1-0603]
R51  10K  [J1-0603]
R52  DNP  [J1-0603]
R53  1K  [J1-0603]
R54  10K  [J1-0603]
R55  10K  [J1-0603]
R56  10K  [J1-0603]
T1  RF Transformer  [WB Series RF Transformers]
U11  3v3 Linear Reg  Supplier Part Number 1: FAN2500S33XCT-ND  [SOT95P245X110-5N]
U12  CM1213A-01SO  Supplier Part Number 1: CM1213A-01SOOSCT-ND  [ONSC-SOT-23-3-318-08_V]
U13  Si4734-D60-GM  Supplier Part Number 1: SI4734-D60-GM-ND  [SLAB-QFN-20-1700x1700TP_V]
U14  CM1213A-01SO  Supplier Part Number 1: CM1213A-01SOOSCT-ND  [ONSC-SOT-23-3-318-08_V]
U15  Sparkfun LLC  [Sparkfun LLC]
Y1  XTAL  Frequency: 12MHz  [XTAL_PDB]

### Ports
AUDIO_FROM_RADIO_L, AUDIO_FROM_RADIO_R, FM_ANT, LP1, LP2, R_CLK, R_ENBL, R_GPIO1, R_GPIO2/INT, R_GPIO2/INT_5v, R_RST_N, R_SCLK, R_SDIO, SCL, SDA

### Nets
5v_SYS: U15.10(HV)
GND: C26.1 C27.1 C28.1 C29.1 C33.1 C34.1 L1.1 Q7.3(S) R54.1 R55.1 T1.3 U11.2(GND) U12.2(VP) U12.3(VN) U13.3(RFGND) U13.12(GND) U13.21(GND) U14.2(VP) U14.3(VN) U15.4(GND) U15.9(GND)
RADIO_VDD: C26.2 C27.2 J1.1 R49.2 R50.2 R51.2 R52.2 R56.2 U13.10(VD) U13.11(VA) U15.3(LV)
NetC25_1: C25.1 U13.4(AMI)
NetC25_2: C25.2 T1.1 U12.1(CH1)
NetC28_2: C28.2 U11.1(Vin)
NetC29_2: C29.2 U11.4(BYP)
NetC30_1: C30.1 U13.14(LOUT/DFS)
NetC30_2: C30.2 ; port AUDIO_FROM_RADIO_L
NetC31_1: C31.1 L1.2 U13.2(FMI) U14.1(CH1)
NetC31_2: C31.2 ; port FM_ANT
NetC32_1: C32.1 U13.13(ROUT/DOUT)
NetC32_2: C32.2 ; port AUDIO_FROM_RADIO_R
NetC33_2: C33.2 U13.17(GPO3/DCLK) Y1.2(OSC2)
NetC34_2: C34.2 U13.9(RCLK) Y1.1(OSC1) ; port R_CLK
NetJ1_2: J1.2 U11.5(Vout)
NetJ8_1: J8.1 T1.4 ; port LP1
NetJ8_2: J8.2 T1.6 ; port LP2
NetQ7_1: Q7.1(D) R49.1 U13.5(~{RST})
NetQ7_2: Q7.2(G) R55.2 ; port R_RST_N
NetR46_1: U15.8(HV3) ; port SCL
NetR47_1: U15.7(HV4) ; port SDA
NetR48_1: R48.1 U13.19(GPO1)
NetR48_2: R48.2 ; port R_GPIO1
NetR50_1: R50.1 U13.7(SCLK) U15.5(LV3) ; port R_SCLK
NetR51_1: R51.1 U13.8(SDIO) U15.6(LV4) ; port R_SDIO
NetR52_1: R52.1 R54.2 U13.6(~{SEN})
NetR53_1: R53.1 U13.18(GPO2/~{INT})
NetR53_2: R53.2 R56.1 U15.1(LV1) ; port R_GPIO2/INT
NetU1_9: U15.12(HV1) ; port R_GPIO2/INT_5v
NetU11_3: U11.3(EN) ; port R_ENBL

Not connected (* = marked no-connect by the designer): T1 2 5; U13 1(NC) 15(DOUT) 16(DFS) 20(NC); U15 2(LV2) 11(HV2)

### Notes on the sheet
- TODO: Enable?!
- TODO: Choose actual MOSFET?
- Title
- Size:
- Date:
- A4
- Radio
- Number:
- Time:
- Revision:
- Sheet
- of
- www.nickmccomb.net
- Nick McComb
- File:
- (in symbol Jumper) + +
- (in symbol RF Transformer) P/N: WB36-1SL; http://www.coilcraft.com/wb_sm.cfm
- (in symbol Sparkfun LLC) SF LLC

### Library data of the parts
C25-C34 = Cap: Capacitor; Published: 8-Jun-2000; LatestRevisionDate: 17-Jul-2002; LatestRevisionNote: Re-released for DXP Platform.; PackageReference: RAD-0.3; Publisher: Altium Limited; PackageDescription: Radial Cap, Thru-Hole; 2 Leads; 0.3 in Pin Spacing
L1 = Inductor: Manufacturer: Murata; Manufacturer Part Number: LQW18ANR18J00D; Description: Fixed Inductors 180 NH 5%; Product Training Modules: Inductor Products Chip RF Inductors; Type: Wirewound; Material - Core: Non-Magnetic; Tolerance: ±5%; Current Rating: 140mA; Shielding: Unshielded; DC Resistance (DCR): 2.2 Ohm Max; Q @ Freq: 25 @ 100MHz; Frequency - Self Resonant: 1.3GHz; Frequency - Test: 100MHz; Online Catalog: LQW Series; Other Names: 490-6928-1; Value: 180nH; Supplier 1: Digikey; Stock 1: 2568; Pricing 1: 1=0.17, 10=0.15, 25=0.1352, 50=0.117, 100=0.105, 250=0.0975, 500=0.09, 750=0.0855, 1000=0.078 (USD); Standard Package: 1; Category: Inductors, Coils, Chokes; Family: Fixed Inductors; Series: LQW18A_00; Packaging: Cut Tape (CT); Inductance: 180nH; Operating Temperature: -55°C ~ 125°C; Mounting Type: Surface Mount; Package / Case: 0603 (1608 Metric); Size / Dimension: 0.063" L x 0.031" W (1.60mm x 0.80mm); Height - Seated (Max): 0.039" (1.00mm); ComponentLink1URL: https://datasheet.ciiva.com/6705/l0075s0080lqw18a-00-6705496.pdf; ComponentLink1Description: https://datasheet.ciiva.com/6705/l0075s0080lqw18a-00-6705496.pdf; ComponentLink2URL: https://datasheet.ciiva.com/6705/l0075s0080lqw18a-00-6705498.pdf; ComponentLink2Description: https://datasheet.ciiva.com/6705/l0075s0080lqw18a-00-6705498.pdf; ComponentLink3URL: https://datasheet.ciiva.com/6705/l0075s0080lqw18a-00-6705500.pdf; ComponentLink3Description: https://datasheet.ciiva.com/6705/l0075s0080lqw18a-00-6705500.pdf; ComponentLink4URL: https://datasheet.ciiva.com/11799/0900766b80a002db-11799164.pdf; ComponentLink4Description: https://datasheet.ciiva.com/11799/0900766b80a002db-11799164.pdf
Q7 = MOSFET-P: P-Channel MOSFET; Published: 8-Jun-2000; LatestRevisionDate: 17-Jul-2002; LatestRevisionNote: Re-released for DXP Platform.; PackageVersion: 1995/1996; PackageReference: E3; Publisher: Altium Limited; PackageDescription: TO, Flat Index; 3 In-Line, Axial Leads; Body Dia. 4.6mm; Lead Dia. 0.5 mm (max)
R48-R56 = Res3: Resistor; Published: 8-Jun-2000; LatestRevisionDate: 29-May-2009; LatestRevisionNote: IPC-7351 Footprint Added.; PackageReference: J1-0603; Publisher: Altium Limited; PackageDescription: Chip Resistor
  R48 R53: Value: 1K
  R49-R51 R54-R56: Value: 10K
  R52: Value: DNP
U11 = 3v3 Linear Reg: Manufacturer: Fairchild Semiconductor; Manufacturer Part Number: FAN2500S33X; Dropout Voltage: 140; Max Input Voltage: 6.5; Min Input Voltage: 2.7; Output Voltage: 3.3; Output Current: 100; Outputs: 1; Supplier 1: Digikey; Stock 1: 32735; Pricing 1: 1=0.63, 10=0.557, 100=0.4259, 500=0.3374, 1000=0.2703 (USD); Mount: Surface Mount; Case/Package: SOT-23-5; Pins: 5; Min Operating Temperature: -40; Max Operating Temperature: 125; Package Quantity: 3000; Packaging: Tape and Reel; Max Ouput Current: 100; Nominal Output Voltage: 3.3; Radiation Hardening: No; REACH SVHC: No SVHC; ComponentLink1URL: https://datasheet.ciiva.com/4886/fan2500-192391-4886672.pdf; ComponentLink1Description: https://datasheet.ciiva.com/4886/fan2500-192391-4886672.pdf; ComponentLink2URL: https://datasheet.ciiva.com/8239/fan2501-8239552.pdf; ComponentLink2Description: https://datasheet.ciiva.com/8239/fan2501-8239552.pdf; ComponentLink3URL: https://datasheet.ciiva.com/16747/fan2500-16747543.pdf; ComponentLink3Description: https://datasheet.ciiva.com/16747/fan2500-16747543.pdf; ComponentLink4URL: https://datasheet.ciiva.com/46426/1727616-46426263.pdf; ComponentLink4Description: https://datasheet.ciiva.com/46426/1727616-46426263.pdf; ComponentLink5URL: https://datasheet.ciiva.com/8241/fan2501-8241034.pdf; ComponentLink5Description: https://datasheet.ciiva.com/8241/fan2501-8241034.pdf; ComponentLink6URL: https://datasheet.ciiva.com/2039/fan2500-2039339.pdf; ComponentLink6Description: https://datasheet.ciiva.com/2039/fan2500-2039339.pdf; ComponentLink7URL: https://datasheet.ciiva.com/48696/001252307-da-01-en-ic-reg-ldo-3-3v-fan2500s33x-sot-23-5-fsc-48696763.pdf; ComponentLink7Description: https://datasheet.ciiva.com/48696/001252307-da-01-en-ic-reg-ldo-3-3v-fan2500s33x-sot-23-5-fsc-48696763.pdf; ComponentLink8URL: https://datasheet.ciiva.com/2039/fan2500-2039340.pdf; ComponentLink8Description: https://datasheet.ciiva.com/2039/fan2500-2039340.pdf
U12 U14 = CMP-1063-00149-1: 1-Channel Low Capacitance ESD Protection Array, 3-Pin SOT-23, Pb-Free, Tape and Reel; Manufacturer: On Semiconductor; Number of Lines: 1; Direction: Unidirectional; C Max (pF): 1.2; PPK Max (W): 0.225; Current Rating: 8; ComponentLink3URL: http://www.onsemi.cn/pub_link/Collateral/318-08.PDF; PackageReference: SOT-23-3-318-08; ComponentLink3Description: Package Specification; IR Max (uA): 1; Packing: Tape and Reel; PackageVersion: Rev. AP, 11/2009; DatasheetVersion: Rev. 8; ComponentLink2Description: Datasheet; PackageDescription: 3-Pin Small Outline Transistor, Body 2.92 x 1.3 mm, Pitch 0.95 mm; PartNumber: CM1213A-01SO; Mounting Technology: Surface Mount; ComponentLink2URL: http://www.onsemi.com/pub_link/Collateral/CM1213A.PDF; ComponentLink1URL: http://www.onsemi.com/; ComponentLink1Description: Manufacturer URL; RoHS: Pb-Free; Supplier 1: Digikey; Manufacturer Part Number: CM1213A-01SO; Stock 1: 2764; Pricing 1: 1=0.47, 10=0.4, 100=0.2985, 500=0.2345, 1000=0.1812 (USD); Mount: Surface Mount; Case/Package: TO-236-3; Pins: 3; Min Operating Temperature: -40; Max Operating Temperature: 85; Elements: 1; Capacitance: 1.2; Channels: 1; Package Quantity: 3000; Packaging: Tape and Reel; Length: 3.04; Height: 1.01; Width: 1.4; Radiation Hardening: No; ComponentLink4URL: https://datasheet.ciiva.com/3304/cm1213a-d-3304000.pdf; ComponentLink4Description: https://datasheet.ciiva.com/3304/cm1213a-d-3304000.pdf; ComponentLink5URL: https://datasheet.ciiva.com/6577/cm1213a-d-6577910.pdf; ComponentLink5Description: https://datasheet.ciiva.com/6577/cm1213a-d-6577910.pdf; ComponentLink6URL: https://datasheet.ciiva.com/6577/cm1213a-d-6577911.pdf; ComponentLink6Description: https://datasheet.ciiva.com/6577/cm1213a-d-6577911.pdf; ComponentLink7URL: https://datasheet.ciiva.com/6577/cm1213a-d-6577912.pdf; ComponentLink7Description: https://datasheet.ciiva.com/6577/cm1213a-d-6577912.pdf; ComponentLink8URL: https://datasheet.ciiva.com/11193/cm1213a-d-11193820.pdf; ComponentLink8Description: https://datasheet.ciiva.com/11193/cm1213a-d-11193820.pdf; ComponentLink9URL: https://datasheet.ciiva.com/25958/cm1213a-d-25958253.pdf; ComponentLink9Description: https://datasheet.ciiva.com/25958/cm1213a-d-25958253.pdf; ComponentLink10URL: https://datasheet.ciiva.com/30478/0900766b8121ba52-30478863.pdf; ComponentLink10Description: https://datasheet.ciiva.com/30478/0900766b8121ba52-30478863.pdf
U13 = CMP-0501-00028-1: Broadcast AM / FM / SW / LW Radio Receiver, -20 to 85 degC, 20-pin QFN, Tray; Manufacturer: Silicon Labs; Sub-Family: AM/FM, Shortwave, Longwave, Weather Band Receivers; RDS Support: FALSE; Frequency: 1.71; ComponentLink2Description: Datasheet; ComponentLink1URL: http://www.silabs.com/; PackageDescription: 20-Pin Quad-Flat No-Leads Package, Body 3 x 3 mm, Pitch 0.5 mm; Mounting Technology: Surface Mount; PartNumber: Si4734-D60-GM; ComponentLink2URL: http://www.silabs.com/Support Documents/TechnicalDocs/Si4730-31-34-35-D60.pdf; ComponentLink3Description: Package Specification; ComponentLink3URL: http://www.silabs.com/Support%20Documents/TechnicalDocs/C8051F99x.pdf; PackageReference: QFN-20; ComponentLink1Description: Manufacturer URL; Code_IPC: J-STD-020; DatasheetVersion: Rev. 1.2; Supplier 1: Digikey; Manufacturer Part Number: SI4734-D60-GM; Stock 1: 624; Pricing 1: 1=14.64, 25=14.1024, 100=13.56, 1000=2.4634 (USD); Mount: Surface Mount; Case/Package: QFN; Pins: 20; Min Operating Temperature: -20; Max Operating Temperature: 85; Package Quantity: 490; Packaging: Tray; Radiation Hardening: No; ComponentLink4URL: https://datasheet.ciiva.com/2798/si4730-31-34-35-d60-2798829.pdf; ComponentLink4Description: https://datasheet.ciiva.com/2798/si4730-31-34-35-d60-2798829.pdf; ComponentLink5URL: https://datasheet.ciiva.com/8147/si4730-31-34-35-d60-8147549.pdf; ComponentLink5Description: https://datasheet.ciiva.com/8147/si4730-31-34-35-d60-8147549.pdf
Y1 = XTAL GENERIC: Crystal Oscillator

## Sheet audioAmp.SchDoc
size A4; Organization: Altium Limited; Address1: L3, 12a Rodborough Rd; Address2: Frenchs Forest; Address3: NSW; Address4: Australia 2086; DocumentNumber: 5; SheetNumber: 5; SheetTotal: 6
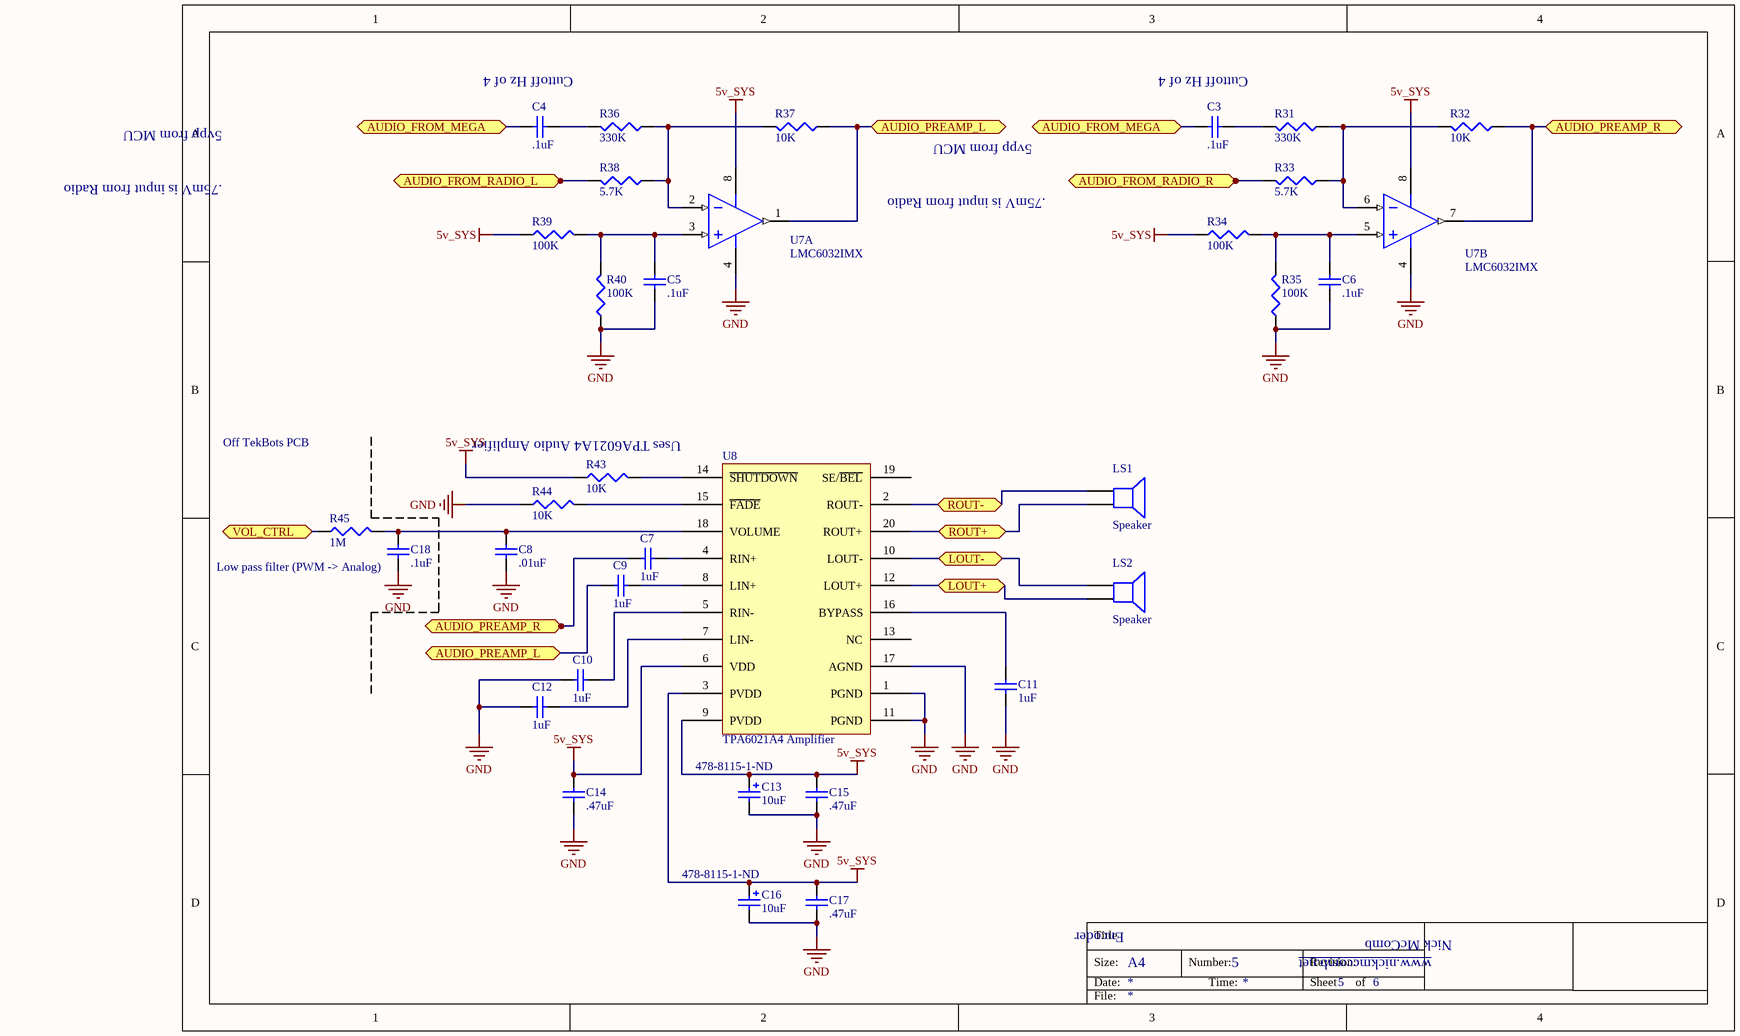
[diagram p5: audioAmp.SchDoc]

### Parts
C3  value .1uF  [C0805]  (hidden comment: 0805 style, by default)
C4  value .1uF  [C0805]  (hidden comment: 0805 style, by default)
C5  value .1uF  [C0805]  (hidden comment: 0805 style, by default)
C6  value .1uF  [C0805]  (hidden comment: 0805 style, by default)
C7  value 1uF  [C0805]  (hidden comment: 0805 style, by default)
C8  value .01uF  [C0805]  (hidden comment: 0805 style, by default)
C9  value 1uF  [C0805]  (hidden comment: 0805 style, by default)
C10  value 1uF  [C0805]  (hidden comment: 0805 style, by default)
C11  value 1uF  [C0805]  (hidden comment: 0805 style, by default)
C12  value 1uF  [C0805]  (hidden comment: 0805 style, by default)
C13  10uF  Supplier Part Number 1: 478-8115-1-ND  [C0805 POLARIZED TANT]
C14  value .47uF  [C0805]  (hidden comment: 0805 style, by default)
C15  value .47uF  [C0805]  (hidden comment: 0805 style, by default)
C16  10uF  Supplier Part Number 1: 478-8115-1-ND  [C0805 POLARIZED TANT]
C17  value .47uF  [C0805]  (hidden comment: 0805 style, by default)
C18  value .1uF  [C0805]  (hidden comment: 0805 style, by default)
LS1  Speaker  [PIN2]
LS2  Speaker  [PIN2]
R31  330K  [J1-0603]
R32  10K  [J1-0603]
R33  5.7K  [J1-0603]
R34  100K  [J1-0603]
R35  100K  [J1-0603]
R36  330K  [J1-0603]
R37  10K  [J1-0603]
R38  5.7K  [J1-0603]
R39  100K  [J1-0603]
R40  100K  [J1-0603]
R43  10K  [J1-0603]
R44  10K  [J1-0603]
R45  1M  [J1-0603]
U7  LMC6032IMX  [D0008A_M]  (parts A,B of 2)
U8  TPA6021A4 Amplifier  [DIP20]

### Ports
AUDIO_FROM_MEGA, AUDIO_FROM_RADIO_L, AUDIO_FROM_RADIO_R, AUDIO_PREAMP_L, AUDIO_PREAMP_R, LOUT+, LOUT-, ROUT+, ROUT-, VOL_CTRL

### Nets
5v_SYS: C13.1 C14.2 C15.2 C16.1 C17.2 R34.1 R39.1 R43.1 U7.8(V+) U8.3(PVDD) U8.6(VDD) U8.9(PVDD)
GND: C5.1 C6.1 C8.1 C10.1 C11.1 C12.1 C13.2 C14.1 C15.1 C16.2 C17.1 C18.1 R35.1 R40.1 R44.1 U7.4(V-) U8.1(PGND) U8.11(PGND) U8.17(AGND)
NetC3_1: C3.1 C4.1 ; port AUDIO_FROM_MEGA
NetC3_2: C3.2 R31.2
NetC4_2: C4.2 R36.2
NetC5_2: C5.2 R39.2 R40.2 U7.3(INA+)
NetC6_2: C6.2 R34.2 R35.2 U7.5(INB+)
NetC7_1: C7.1 R32.1 U7.7(OUTB) ; port AUDIO_PREAMP_R
NetC7_2: C7.2 U8.4(RIN+)
NetC8_2: C8.2 C18.2 R45.2 U8.18(VOLUME)
NetC9_1: C9.1 R37.1 U7.1(OUTA) ; port AUDIO_PREAMP_L
NetC9_2: C9.2 U8.8(LIN+)
NetC10_2: C10.2 U8.5(RIN-)
NetC11_2: C11.2 U8.16(BYPASS)
NetC12_2: C12.2 U8.7(LIN-)
NetC30_2: R38.2 ; port AUDIO_FROM_RADIO_L
NetC32_2: R33.2 ; port AUDIO_FROM_RADIO_R
NetLS1_1: LS1.1 U8.2(ROUT-) ; port ROUT-
NetLS1_2: LS1.2 U8.20(ROUT+) ; port ROUT+
NetLS2_1: LS2.1 U8.10(LOUT-) ; port LOUT-
NetLS2_2: LS2.2 U8.12(LOUT+) ; port LOUT+
NetR31_1: R31.1 R32.2 R33.1 U7.6(INB-)
NetR36_1: R36.1 R37.2 R38.1 U7.2(INA-)
NetR43_2: R43.2 U8.14(~{SHUTDOWN})
NetR44_2: R44.2 U8.15(~{FADE})
NetR45_1: R45.1 ; port VOL_CTRL

Not connected (* = marked no-connect by the designer): U8 13(NC) 19(SE/~{BEL})

### Notes on the sheet
- Cuttoff Hz of 4
- .75mV is input from Radio
- 5vpp from MCU
- (near R34) .75mV is input from Radio
- Off TekBots PCB
- (near U8) Uses TPA6021A4 Audio Amplifier
- (near C18) Low pass filter (PWM -> Analog)
- Encoder
- Title
- Size:
- Date:
- A4
- Number:
- Time:
- Revision:
- Sheet
- of
- www.nickmccomb.net
- Nick McComb
- File:

### Library data of the parts
C3-C12 C14 C15 C17 C18 = Cap: Capacitor; Published: 8-Jun-2000; LatestRevisionDate: 17-Jul-2002; LatestRevisionNote: Re-released for DXP Platform.; PackageReference: RAD-0.3; Publisher: Altium Limited; PackageDescription: Radial Cap, Thru-Hole; 2 Leads; 0.3 in Pin Spacing
C13 C16 = Cap Pol: Polarized Capacitor (Radial); Manufacturer: Kyocera / AVX; Manufacturer Part Number: F920J106MPA; Description: NICHICON         F920J106MPA             TANTALUM CAPACITOR, 10UF, 6.3V, 6 OHM, 0.2, 2012-12; Capacitance: 10000000 pF; Case Style: Molded; DCL: 0.6 uA; DF: 10%; ESR: 6 ohm; Insulation: Not Required; Lead Spacing (nom): Not Required mm; Polarity: Polar; Product Depth (mm): 1.25 mm; Product Height (mm): 1.1 mm; Product Length (mm): 2 mm; Rad Hardened: No; Tolerance (+ or -): 20%; Voltage: 6.3VDC; Value: 10uF; Supplier 1: Digikey; Stock 1: 99324; Pricing 1: 1=0.31, 10=0.218, 25=0.1792, 50=0.1528, 100=0.131, 250=0.1092, 500=0.0983, 1000=0.083 (USD); Case Code: P; Construction: SMT Chip; Failure Rate: Not Required; Length W/Weld: Not Required mm; Mounting Style: Surface Mount; Operating Temp Range: -55C to 125C; Packaging: Tape and Reel; Product Diameter (mm): Not Required mm; Seal: Not Required; Seated Plane Height: Not Required mm; Wire Form: Not Required; ComponentLink1URL: https://datasheet.ciiva.com/14863/f92-14863120.pdf; ComponentLink1Description: https://datasheet.ciiva.com/14863/f92-14863120.pdf; ComponentLink2URL: https://datasheet.ciiva.com/30526/getdatasheetpartid-436170-30526657.pdf; ComponentLink2Description: https://datasheet.ciiva.com/30526/getdatasheetpartid-436170-30526657.pdf; ComponentLink3URL: https://datasheet.ciiva.com/14599/70188318-14599013.pdf; ComponentLink3Description: https://datasheet.ciiva.com/14599/70188318-14599013.pdf; ComponentLink4URL: https://datasheet.ciiva.com/17336/e-f92-17336710.pdf; ComponentLink4Description: https://datasheet.ciiva.com/17336/e-f92-17336710.pdf; ComponentLink5URL: https://datasheet.ciiva.com/7654/e-f92-7654794.pdf; ComponentLink5Description: https://datasheet.ciiva.com/7654/e-f92-7654794.pdf; ComponentLink6URL: https://datasheet.ciiva.com/11223/e-f92-11223515.pdf; ComponentLink6Description: https://datasheet.ciiva.com/11223/e-f92-11223515.pdf; ComponentLink7URL: https://datasheet.ciiva.com/257/e-f92-257500.pdf; ComponentLink7Description: https://datasheet.ciiva.com/257/e-f92-257500.pdf; ComponentLink8URL: https://datasheet.ciiva.com/257/e-f92-257501.pdf; ComponentLink8Description: https://datasheet.ciiva.com/257/e-f92-257501.pdf; ComponentLink9URL: https://datasheet.ciiva.com/14863/f92-14863133.pdf; ComponentLink9Description: https://datasheet.ciiva.com/14863/f92-14863133.pdf; ComponentLink10URL: https://datasheet.ciiva.com/257/e-f92-257502.pdf; ComponentLink10Description: https://datasheet.ciiva.com/257/e-f92-257502.pdf; ComponentLink11URL: https://datasheet.ciiva.com/14863/f92-14863118.pdf; ComponentLink11Description: https://datasheet.ciiva.com/14863/f92-14863118.pdf
LS1 LS2 = Speaker: Loudspeaker; Published: 24-Mar-1999; LatestRevisionDate: 17-Jul-2002; LatestRevisionNote: Re-released for DXP Platform.; PackageReference: PIN2; Publisher: Altium Limited
R31-R40 R43-R45 = Res3: Resistor; Published: 8-Jun-2000; LatestRevisionDate: 29-May-2009; LatestRevisionNote: IPC-7351 Footprint Added.; PackageReference: J1-0603; Publisher: Altium Limited; PackageDescription: Chip Resistor
  R31 R36: Value: 330K
  R32 R37 R43 R44: Value: 10K
  R33 R38: Value: 5.7K
  R34 R35 R39 R40: Value: 100K
  R45: Value: 1M
U7 = CMP-0055-00692-3: CMOS Dual Operational Amplifier, 8-pin Narrow SOIC; Manufacturer: Texas Instruments; PowerWise: N; PackageTopMarking: NSZXTT*LMC60*32IM; CompType: Amplifiers; PinCount: 8; ComponentLink1URL: http://www.ti.com/general/docs/lit/getliterature.tsp?genericPartNumber=LMC6032&fileType=pdf; Package Reference: D0008A; Code_JEDEC: MS-012-AA; Code_IPC: SOIC127P600-8; ComponentLink1Description: Datasheet URL; PackageDescription: SOIC Narrow, 4.9 x 3.9 x 1.45mm, 8 Lead, 1.27mm Pitch; RoHS: N; PartId: 1
U8 = TPA6021A4 Amplifier: Audio Amplifier

## Sheet serial.SchDoc
size A4; Organization: Altium Limited; Address1: L3, 12a Rodborough Rd; Address2: Frenchs Forest; Address3: NSW; Address4: Australia 2086; DocumentNumber: 7; SheetNumber: 7; SheetTotal: 7
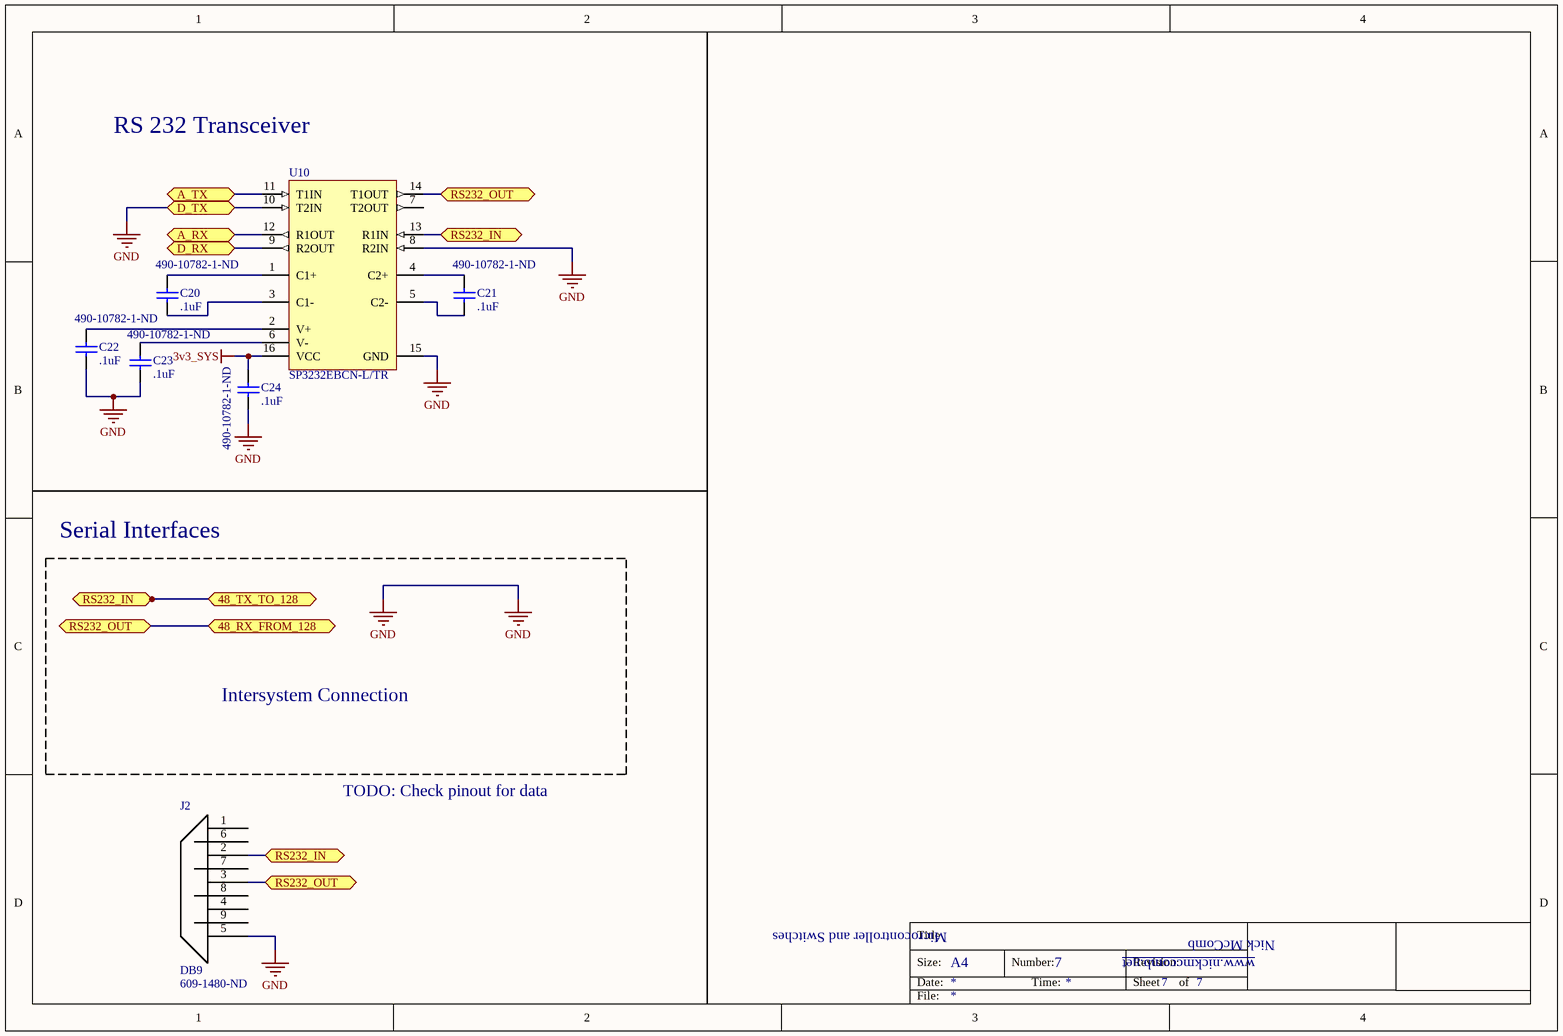
[diagram p6: serial.SchDoc]

### Parts
C20  value .1uF  Supplier Part Number 1: 490-10782-1-ND  [C0805]  (hidden comment: 0805 style, by default)
C21  value .1uF  Supplier Part Number 1: 490-10782-1-ND  [C0805]  (hidden comment: 0805 style, by default)
C22  value .1uF  Supplier Part Number 1: 490-10782-1-ND  [C0805]  (hidden comment: 0805 style, by default)
C23  value .1uF  Supplier Part Number 1: 490-10782-1-ND  [C0805]  (hidden comment: 0805 style, by default)
C24  value .1uF  Supplier Part Number 1: 490-10782-1-ND  [C0805]  (hidden comment: 0805 style, by default)
J2  DB9  Supplier Part Number 1: 609-1480-ND  [DSUB CONNECTOR]
U10  SP3232EBCN-L/TR  [EXAR-NSOIC-16_N]

### Ports
48_RX_FROM_128, 48_TX_TO_128, A_RX, A_TX, D_RX, D_TX, RS232_IN, RS232_OUT

### Nets
3v3_SYS: C24.2 U10.16(VCC)
GND: C22.1 C23.1 C24.1 J2.5 U10.8(R2IN) U10.10(T2IN) U10.15(GND) ; port D_TX
NetC20_1: C20.1 U10.3(C1-)
NetC20_2: C20.2 U10.1(C1+)
NetC21_1: C21.1 U10.5(C2-)
NetC21_2: C21.2 U10.4(C2+)
NetC22_2: C22.2 U10.2(V+)
NetC23_2: C23.2 U10.6(V-)
NetJ2_2: J2.2 U10.13(R1IN) ; port RS232_IN, port 48_TX_TO_128
NetJ2_3: J2.3 U10.14(T1OUT) ; port RS232_OUT, port 48_RX_FROM_128
NetU1_2: U10.12(R1OUT) ; port A_RX
NetU1_3: U10.11(T1IN) ; port A_TX
NetU10_9: U10.9(R2OUT) ; port D_RX

Not connected (* = marked no-connect by the designer): J2 1 4 6 7 8 9; U10 7(T2OUT)

### Notes on the sheet
- RS 232 Transceiver
- Serial Interfaces
- Intersystem Connection
- TODO: Check pinout for data
- Microcontroller and Switches
- Title
- Size:
- Date:
- A4
- Number:
- Time:
- Revision:
- Sheet
- of
- www.nickmccomb.net
- Nick McComb
- File:

### Library data of the parts
C20-C24 = Cap: Capacitor; Manufacturer: Murata Electronics North America; Manufacturer Part Number: GRM21BR71H104JA01L; Capacitance: 0.10µF; Tolerance: ±5%; Voltage - Rated: 50V; Temperature Coefficient: X7R; Published: 8-Jun-2000; LatestRevisionDate: 17-Jul-2002; LatestRevisionNote: Re-released for DXP Platform.; PackageReference: RAD-0.3; Publisher: Altium Limited; PackageDescription: Radial Cap, Thru-Hole; 2 Leads; 0.3 in Pin Spacing; Supplier 1: Digi-Key; RoHS: RoHS Compliant; Category: Capacitors; Stock 1: 17503; Pricing 1: 1=0.16, 10=0.113, 50=0.065, 100=0.0537, 250=0.0452, 500=0.03786, 1000=0.03108 (USD); Packaging: Cut Tape (CT); Mounting Type: Surface Mount, MLCC; Operating Temperature: -55°C ~ 125°C; Applications: General Purpose; Ratings: -; Package / Case: 0805 (2012 Metric); Size / Dimension: 0.079" L x 0.049" W (2.00mm x 1.25mm); Height - Seated (Max): -; Thickness (Max): 0.053" (1.35mm); Lead Spacing: -; Features: -; Lead Style: -; ComponentLink1URL: http://www.murata.com/~/media/webrenewal/support/library/catalog/products/capacitor/mlcc/c02e.pdf; ComponentLink1Description: http://www.murata.com/~/media/webrenewal/support/library/catalog/products/capacitor/mlcc/c02e.pdf
J2 = DB9: Manufacturer: Amphenol / FCI; Manufacturer Part Number: D09P33E4GV00LF; Connector Style: D-Sub; Connector Type: Plug, Male Pins; Number of Positions: 9; Flange Feature: Mating Side, Female Screwlock (4-40); Voltage Rating: 300V; Current Rating: 5A; Supplier 1: Digikey; Stock 1: 5536; Pricing 1: 1=2.3, 10=2.086, 25=1.958, 50=1.8728, 100=1.7877, 250=1.6175, 500=1.4898, 1000=1.277, 2500=1.1918 (USD); Category: Connectors, Interconnects; Family: D-Sub Connectors; Series: Delta D; Packaging: Tray; Number of Rows: 2; Shell Size, Connector Layout: 1 (DE, E); Contact Type: Signal; Mounting Type: Through Hole, Right Angle; Termination: Solder; Features: Board Lock, Grounding Indents; Shell Material, Finish: Steel, Tin Plated; Contact Finish: Gold; Contact Finish Thickness: Flash; Ingress Protection: -; Operating Temperature: -55°C ~ 125°C; Housing Material: Polybutylene Terephthalate (PBT); Color: Black; ComponentLink1URL: https://datasheet.ciiva.com/16915/70236919-16915382.pdf; ComponentLink1Description: https://datasheet.ciiva.com/16915/70236919-16915382.pdf; ComponentLink2URL: https://datasheet.ciiva.com/15177/getdatasheetpartid-123290-15177610.pdf; ComponentLink2Description: https://datasheet.ciiva.com/15177/getdatasheetpartid-123290-15177610.pdf; ComponentLink3URL: https://datasheet.ciiva.com/10376/c01-8646-0151-10376667.pdf; ComponentLink3Description: https://datasheet.ciiva.com/10376/c01-8646-0151-10376667.pdf; ComponentLink4URL: https://datasheet.ciiva.com/652/c01-8646-0151-652476.pdf; ComponentLink4Description: https://datasheet.ciiva.com/652/c01-8646-0151-652476.pdf; ComponentLink5URL: https://datasheet.ciiva.com/16663/c01-8646-0151-16663004.pdf; ComponentLink5Description: https://datasheet.ciiva.com/16663/c01-8646-0151-16663004.pdf
U10 = CMP-0935-00001-1: RS-232 Transceiver with 2-Drivers / 2-Receivers, 3 to 5.5 V, 250 Kbps, 16-Pin NSOIC, 0 to 70 degC, Pb-free, Tape and Reel; Manufacturer: Exar Corporation; No. of Tx: 2; ESD: 15 KV; ComponentLink1URL: http://www.exar.com/; ComponentLink1Description: Manufacturer URL; PackageDescription: 16-Pin Small Outline Integrated Circuit, Body 9.9 x 3.9 mm, Pitch 1.27 mm; Data Rate: 250 Kbps; No. of Rx: 2; DatasheetVersion: Rev. 1.0.2; Packing: Tape and Reel; PartNumber: SP3232EBCN-L/TR; Temp. Range: 0 to 70 degC; VCC: 3 to 5.5 V; ComponentLink2Description: Datasheet; PackageReference: NSOIC-16; Mounting Technology: Surface Mount; ComponentLink2URL: https://www.exar.com/common/content/document.ashx?id=632&languageid=1033

## Nets that join several sheets
5v_SYS: uC (11 pins), barGraph (C1.2 U5.16), 7Seg (C35.2 Q6.3 U2.6 U2.16), encoder (8 pins), radio (U15.10), audioAmp (12 pins)
GND: uC (9 pins), barGraph (10 pins), 7Seg (C35.1 U2.4 U2.5 U2.8), encoder (C2.1 SW1.2 SW2.2 U6.8), radio (21 pins), audioAmp (19 pins), serial (7 pins)
NetC3_1: uC (U1.29), audioAmp (C3.1 C4.1)
NetC30_2: radio (C30.2), audioAmp (R38.2)
NetC32_2: radio (C32.2), audioAmp (R33.2)
NetD1_1: uC (D1.1 U1.51), 7Seg (R8.1)
NetD2_1: uC (D2.1 U1.50), 7Seg (R7.1)
NetD3_1: uC (D3.1 U1.49), 7Seg (R6.1)
NetD4_1: uC (D4.1 U1.48), 7Seg (R5.1)
NetD5_1: uC (D5.1 U1.47), 7Seg (R4.1)
NetD6_1: uC (D6.1 U1.46), 7Seg (R3.1)
NetD7_1: uC (D7.1 U1.45), 7Seg (R2.1)
NetD8_1: uC (D8.1 U1.44), 7Seg (R1.1)
NetQ7_2: uC (U1.4), radio (Q7.2 R55.2)
NetR30_1: uC (U1.17), 7Seg (R30.1)
NetR45_1: uC (U1.5), audioAmp (R45.1)
NetR46_1: uC (R46.1 U1.25 U9.4), radio (U15.8)
NetR47_1: uC (R47.1 U1.26 U9.6), radio (U15.7)
NetR57_1: uC (R57.1), barGraph (U5.14)
NetR58_1: uC (R58.1), barGraph (U5.11), encoder (U6.2)
NetR59_1: uC (R59.1), encoder (U6.9)
NetU1_2: uC (U1.2), serial (U10.12)
NetU1_3: uC (U1.3), serial (U10.11)
NetU1_6: uC (U1.6), encoder (U6.1)
NetU1_8: uC (U1.8), encoder (U6.15)
NetU1_9: uC (U1.9), radio (U15.12)
NetU1_14: uC (U1.14), 7Seg (U2.1)
NetU1_15: uC (U1.15), 7Seg (U2.2)
NetU1_16: uC (U1.16), 7Seg (U2.3)
NetU2_7: uC (U3.1), 7Seg (U2.7)